# Altium project Compressor.PrjPcb (part 4 of 4)
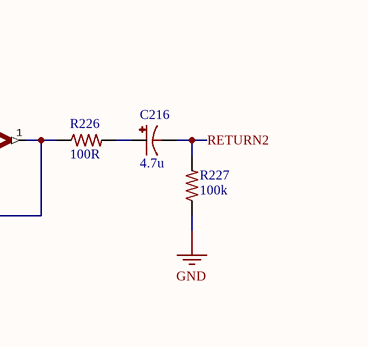
[diagram p6: Compressor.SchDoc, bottom right]

## Sheet Compressor.SchDoc (continued)

### Library data of the parts (continued)
R120 R222 R226 = CRCW0603100RFKEA: RES SMD 100 OHM 1% 1/10W 0603; Manufacturer: Vishay Dale; Power Rating: 100mW; Temperature Coefficient: 100ppm/°C; Voltage Rating (DC): 75V; Supplier 1: Farnell; Supplier Part Number 1: 1469752; Manufacturer Part Number: CRCW0603100RFKEA; Stock: 394970; Pricing: 10=0.0171, 100=0.0131, 500=0.0114, 1000=0.0068 (EUR); RoHS: Yes; Mount: Surface Mount; Case/Package: 0603; Number of Pins: 2; Weight: 7.1E-05oz; Contact Plating: Tin; Case Code (Metric): 1608; Case Code (Imperial): 0603; Min Operating Temperature: -55°C; Max Operating Temperature: 155°C; Resistance: 100R; Tolerance: 1%; Composition: Thick Film; Packaging: Tape and Reel; Package Quantity: 10; Voltage Rating: 75V; Number of Terminations: 2; Termination: SMD/SMT; Military Standard: Not; Max Power Dissipation: 100mW; Features: Automotive AEC-Q200; Length: 1.55mm; Height: 0.02inch; Width: 0.033inch; Depth: 0.85mm; Radiation Hardening: No; Lead Free: Lead Free; REACH SVHC: Unknown; ComponentLink1URL: https://datasheet.ciiva.com/16941/dcrcwe3-16941318.pdf?src-supplier=Avnet+Europe; ComponentLink1Description: https://datasheet.ciiva.com/16941/dcrcwe3-16941318.pdf?src-supplier=Avnet+Europe; ComponentLink2URL: https://datasheet.ciiva.com/2465/dcrcwe3-2465543.pdf?src-supplier=Digi-Key; ComponentLink2Description: https://datasheet.ciiva.com/2465/dcrcwe3-2465543.pdf?src-supplier=Digi-Key; ComponentLink3URL: https://datasheet.ciiva.com/2465/dcrcwe3-2465544.pdf?src-supplier=Digi-Key; ComponentLink3Description: https://datasheet.ciiva.com/2465/dcrcwe3-2465544.pdf?src-supplier=Digi-Key; ComponentLink4URL: https://datasheet.ciiva.com/2465/dcrcwe3-2465545.pdf?src-supplier=Digi-Key; ComponentLink4Description: https://datasheet.ciiva.com/2465/dcrcwe3-2465545.pdf?src-supplier=Digi-Key; ComponentLink5URL: https://datasheet.ciiva.com/22673/1697337-22673066.pdf?src-supplier=Element14; ComponentLink5Description: https://datasheet.ciiva.com/22673/1697337-22673066.pdf?src-supplier=Element14; ComponentLink6URL: https://datasheet.ciiva.com/16199/dcrcwe3-16199102.pdf?src-supplier=Future+Electronics; ComponentLink6Description: https://datasheet.ciiva.com/16199/dcrcwe3-16199102.pdf?src-supplier=Future+Electronics; ComponentLink7URL: https://datasheet.ciiva.com/16721/70201119-16721486.pdf?src-supplier=Allied+Electronics; ComponentLink7Description: https://datasheet.ciiva.com/16721/70201119-16721486.pdf?src-supplier=Allied+Electronics; ComponentLink8URL: https://datasheet.ciiva.com/22666/1720486-22666207.pdf?src-supplier=Element14; ComponentLink8Description: https://datasheet.ciiva.com/22666/1720486-22666207.pdf?src-supplier=Element14; ComponentLink9URL: https://datasheet.ciiva.com/26316/fld-crcw-e3-data-en-26316566.pdf?src-supplier=Distrelec; ComponentLink9Description: https://datasheet.ciiva.com/26316/fld-crcw-e3-data-en-26316566.pdf?src-supplier=Distrelec; ComponentLink10URL: https://datasheet.ciiva.com/16787/70201119-16787964.pdf?src-supplier=Allied+Electronics; ComponentLink10Description: https://datasheet.ciiva.com/16787/70201119-16787964.pdf?src-supplier=Allied+Electronics; ComponentLink11URL: https://datasheet.ciiva.com/5550/dcrcwe3-109170-5550286.pdf?src-supplier=Mouser; ComponentLink11Description: https://datasheet.ciiva.com/5550/dcrcwe3-109170-5550286.pdf?src-supplier=Mouser; Price: 0.0129
R122 = CRCW0603300KFKEA: RES SMD 300K OHM 1% 1/10W 0603; Manufacturer: Vishay; Resistance: 300kR; Temperature Coefficient: 100ppm/°C; Power Rating: 100mW; Voltage Rating: 75V; Supplier 1: Farnell; Supplier Part Number 1: 1652871; Manufacturer Part Number: CRCW0603300KFKEA; RoHS: Yes; Category: Chip SMD Resistors; Stock: 21563; Pricing: 10=0.04580, 100=0.01840, 500=0.01410, 1000=0.00700, 2500=0.00580 (EUR); Mount: Surface Mount; Case/Package: 0603; Number of Pins: 2; Weight: 7.1E-05oz; Contact Plating: Tin; Case Code (Metric): 1608; Case Code (Imperial): 0603; Min Operating Temperature: -55°C; Max Operating Temperature: 155°C; Tolerance: 1%; Composition: Thick Film; Packaging: Tape and Reel; Number of Terminations: 2; Termination: SMD/SMT; Max Power Dissipation: 100mW; Package Quantity: 10; Features: Automotive AEC-Q200; Military Standard: Not; Voltage Rating (DC): 75V; Length: 1.55mm; Height: 0.45mm; Width: 0.033inch; Depth: 0.85mm; Radiation Hardening: No; Lead Free: Lead Free; REACH SVHC: Unknown; ComponentLink1URL: https://datasheet.ciiva.com/11818/0900766b80d98afc-11818169.pdf?src-supplier=RSComponents; ComponentLink1Description: https://datasheet.ciiva.com/11818/0900766b80d98afc-11818169.pdf?src-supplier=RSComponents; ComponentLink2URL: https://datasheet.ciiva.com/7674/1697337-7674069.pdf?src-supplier=Element14; ComponentLink2Description: https://datasheet.ciiva.com/7674/1697337-7674069.pdf?src-supplier=Element14; ComponentLink3URL: https://datasheet.ciiva.com/7674/1533075-7674214.pdf?src-supplier=Element14; ComponentLink3Description: https://datasheet.ciiva.com/7674/1533075-7674214.pdf?src-supplier=Element14; ComponentLink4URL: https://datasheet.ciiva.com/16784/70201119-16784232.pdf?src-supplier=Allied+Electronics; ComponentLink4Description: https://datasheet.ciiva.com/16784/70201119-16784232.pdf?src-supplier=Allied+Electronics; ComponentLink5URL: https://datasheet.ciiva.com/26317/fld-crcw-e3-data-en-26317176.pdf?src-supplier=Distrelec; ComponentLink5Description: https://datasheet.ciiva.com/26317/fld-crcw-e3-data-en-26317176.pdf?src-supplier=Distrelec; ComponentLink6URL: https://datasheet.ciiva.com/16893/dcrcwe3-16893193.pdf?src-supplier=Avnet+Europe; ComponentLink6Description: https://datasheet.ciiva.com/16893/dcrcwe3-16893193.pdf?src-supplier=Avnet+Europe; ComponentLink7URL: https://datasheet.ciiva.com/5549/dcrcwe3-109170-5549837.pdf?src-supplier=Mouser; ComponentLink7Description: https://datasheet.ciiva.com/5549/dcrcwe3-109170-5549837.pdf?src-supplier=Mouser; ComponentLink8URL: https://datasheet.ciiva.com/2466/dcrcwe3-2466314.pdf?src-supplier=Digi-Key; ComponentLink8Description: https://datasheet.ciiva.com/2466/dcrcwe3-2466314.pdf?src-supplier=Digi-Key; ComponentLink9URL: https://datasheet.ciiva.com/2466/dcrcwe3-2466315.pdf?src-supplier=Digi-Key; ComponentLink9Description: https://datasheet.ciiva.com/2466/dcrcwe3-2466315.pdf?src-supplier=Digi-Key; ComponentLink10URL: https://datasheet.ciiva.com/2466/dcrcwe3-2466316.pdf?src-supplier=Digi-Key; ComponentLink10Description: https://datasheet.ciiva.com/2466/dcrcwe3-2466316.pdf?src-supplier=Digi-Key
R124 = CRCW060327K0FKEA: RES SMD 27K OHM 1% 1/10W 0603; Manufacturer: Vishay; Resistance: 27kR; Power Rating: 100mW; Temperature Coefficient: 100ppm/°C; Voltage Rating: 75V; Supplier 1: Farnell; Supplier Part Number 1: 1652864; Manufacturer Part Number: CRCW060327K0FKEA; Stock: 74674; Pricing: 10=0.0169, 100=0.013, 500=0.0113, 1000=0.0068 (EUR); RoHS: Yes; Mount: Surface Mount; Case/Package: 0603; Number of Pins: 2; Weight: 7.1E-05oz; Contact Plating: Tin; Case Code (Imperial): 0603; Case Code (Metric): 1608; Min Operating Temperature: -55°C; Max Operating Temperature: 155°C; Tolerance: 1%; Composition: Thick Film; Packaging: Tape and Reel; Termination: SMD/SMT; Package Quantity: 10; Number of Terminations: 2; Military Standard: Not; Max Power Dissipation: 100mW; Voltage Rating (DC): 75V; Features: Automotive AEC-Q200; Length: 1.55mm; Height: 0.45mm; Width: 0.85mm; Depth: 0.85mm; Radiation Hardening: No; REACH SVHC: Unknown; Lead Free: Lead Free; ComponentLink1URL: https://datasheet.ciiva.com/11810/0900766b80d98afc-11810797.pdf?src-supplier=RSComponents; ComponentLink1Description: https://datasheet.ciiva.com/11810/0900766b80d98afc-11810797.pdf?src-supplier=RSComponents; ComponentLink2URL: https://datasheet.ciiva.com/7841/1697337-7841575.pdf?src-supplier=Element14; ComponentLink2Description: https://datasheet.ciiva.com/7841/1697337-7841575.pdf?src-supplier=Element14; ComponentLink3URL: https://datasheet.ciiva.com/15159/getdatasheetpartid-45808-15159562.pdf?src-supplier=Verical; ComponentLink3Description: https://datasheet.ciiva.com/15159/getdatasheetpartid-45808-15159562.pdf?src-supplier=Verical; ComponentLink4URL: https://datasheet.ciiva.com/26314/fld-crcw-e3-data-en-26314668.pdf?src-supplier=Distrelec; ComponentLink4Description: https://datasheet.ciiva.com/26314/fld-crcw-e3-data-en-26314668.pdf?src-supplier=Distrelec; ComponentLink5URL: https://datasheet.ciiva.com/2466/dcrcwe3-2466269.pdf?src-supplier=Digi-Key; ComponentLink5Description: https://datasheet.ciiva.com/2466/dcrcwe3-2466269.pdf?src-supplier=Digi-Key; ComponentLink6URL: https://datasheet.ciiva.com/2466/dcrcwe3-2466271.pdf?src-supplier=Digi-Key; ComponentLink6Description: https://datasheet.ciiva.com/2466/dcrcwe3-2466271.pdf?src-supplier=Digi-Key; ComponentLink7URL: https://datasheet.ciiva.com/16395/dcrcwe3-16395398.pdf?src-supplier=Future+Electronics; ComponentLink7Description: https://datasheet.ciiva.com/16395/dcrcwe3-16395398.pdf?src-supplier=Future+Electronics; ComponentLink8URL: https://datasheet.ciiva.com/16893/dcrcw-16893962.pdf?src-supplier=Avnet+Europe; ComponentLink8Description: https://datasheet.ciiva.com/16893/dcrcw-16893962.pdf?src-supplier=Avnet+Europe; ComponentLink9URL: https://datasheet.ciiva.com/2466/dcrcwe3-2466270.pdf?src-supplier=Digi-Key; ComponentLink9Description: https://datasheet.ciiva.com/2466/dcrcwe3-2466270.pdf?src-supplier=Digi-Key; ComponentLink10URL: https://datasheet.ciiva.com/22871/70201119-22871598.pdf?src-supplier=Allied+Electronics; ComponentLink10Description: https://datasheet.ciiva.com/22871/70201119-22871598.pdf?src-supplier=Allied+Electronics; Price: 0.0129
R127 R212 R215 R224 R227 = CRCW0603100KFKEA: RES SMD 100K OHM 1% 1/10W 0603; Manufacturer: Vishay; Resistance: 100kR; Temperature Coefficient: 100ppm/°C; Power Rating: 100mW; Voltage Rating: 75V; Supplier 1: Farnell; Supplier Part Number 1: 1469649; Manufacturer Part Number: CRCW0603100KFKEA; Stock: 573766; Pricing: 10=0.0169, 100=0.013, 500=0.0113, 1000=0.0068 (EUR); RoHS: Yes; Case/Package: 0603; Number of Pins: 2; Weight: 7.1E-05oz; Contact Plating: Tin; Case Code (Metric): 1608; Case Code (Imperial): 0603; Min Operating Temperature: -55°C; Max Operating Temperature: 155°C; Tolerance: 1%; Composition: Thick Film; Termination: SMD/SMT; Packaging: Tape and Reel; Package Quantity: 10; Number of Terminations: 2; Military Standard: Not; Max Power Dissipation: 100mW; Voltage Rating (DC): 75V; Features: Automotive AEC-Q200; Length: 1.55mm; Height: 0.45mm; Width: 0.033inch; Depth: 0.85mm; Radiation Hardening: No; Lead Free: Lead Free; REACH SVHC: Unknown; ComponentLink1URL: https://datasheet.ciiva.com/11809/0900766b80d98afc-11809004.pdf?src-supplier=RSComponents; ComponentLink1Description: https://datasheet.ciiva.com/11809/0900766b80d98afc-11809004.pdf?src-supplier=RSComponents; ComponentLink2URL: https://datasheet.ciiva.com/2465/dcrcwe3-2465525.pdf?src-supplier=Digi-Key; ComponentLink2Description: https://datasheet.ciiva.com/2465/dcrcwe3-2465525.pdf?src-supplier=Digi-Key; ComponentLink3URL: https://datasheet.ciiva.com/7777/1697337-7777269.pdf?src-supplier=Element14; ComponentLink3Description: https://datasheet.ciiva.com/7777/1697337-7777269.pdf?src-supplier=Element14; ComponentLink4URL: https://datasheet.ciiva.com/15159/getdatasheetpartid-93113-15159925.pdf?src-supplier=Verical; ComponentLink4Description: https://datasheet.ciiva.com/15159/getdatasheetpartid-93113-15159925.pdf?src-supplier=Verical; ComponentLink5URL: https://datasheet.ciiva.com/46441/1720486-46441605.pdf?src-supplier=Element14; ComponentLink5Description: https://datasheet.ciiva.com/46441/1720486-46441605.pdf?src-supplier=Element14; ComponentLink6URL: https://datasheet.ciiva.com/2465/dcrcwe3-2465526.pdf?src-supplier=Digi-Key; ComponentLink6Description: https://datasheet.ciiva.com/2465/dcrcwe3-2465526.pdf?src-supplier=Digi-Key; ComponentLink7URL: https://datasheet.ciiva.com/2465/dcrcwe3-2465527.pdf?src-supplier=Digi-Key; ComponentLink7Description: https://datasheet.ciiva.com/2465/dcrcwe3-2465527.pdf?src-supplier=Digi-Key; ComponentLink8URL: https://datasheet.ciiva.com/8340/dcrcwe3-8340199.pdf?src-supplier=Avnet; ComponentLink8Description: https://datasheet.ciiva.com/8340/dcrcwe3-8340199.pdf?src-supplier=Avnet; ComponentLink9URL: https://datasheet.ciiva.com/16725/70201119-16725223.pdf?src-supplier=Allied+Electronics; ComponentLink9Description: https://datasheet.ciiva.com/16725/70201119-16725223.pdf?src-supplier=Allied+Electronics; ComponentLink10URL: https://datasheet.ciiva.com/8340/dcrcwe3-8340201.pdf?src-supplier=Avnet; ComponentLink10Description: https://datasheet.ciiva.com/8340/dcrcwe3-8340201.pdf?src-supplier=Avnet; ComponentLink11URL: https://datasheet.ciiva.com/7791/66915-7791994.pdf?src-supplier=Element14; ComponentLink11Description: https://datasheet.ciiva.com/7791/66915-7791994.pdf?src-supplier=Element14; ComponentLink12URL: https://datasheet.ciiva.com/5545/dcrcwe3-109170-5545100.pdf?src-supplier=Mouser; ComponentLink12Description: https://datasheet.ciiva.com/5545/dcrcwe3-109170-5545100.pdf?src-supplier=Mouser; ComponentLink13URL: https://datasheet.ciiva.com/26317/fld-crcw-e3-data-en-26317165.pdf?src-supplier=Distrelec; ComponentLink13Description: https://datasheet.ciiva.com/26317/fld-crcw-e3-data-en-26317165.pdf?src-supplier=Distrelec; ComponentLink14URL: https://datasheet.ciiva.com/16941/dcrcw-16941311.pdf?src-supplier=Avnet+Europe; ComponentLink14Description: https://datasheet.ciiva.com/16941/dcrcw-16941311.pdf?src-supplier=Avnet+Europe; Price: 0.0136
R128 = CRCW0603120KFKEA: RES SMD 120K OHM 1% 1/10W 0603; Manufacturer: Vishay; Resistance: 120kR; Temperature Coefficient: 100ppm/°C; Power Rating: 100mW; Voltage Rating: 75V; Supplier 1: Farnell; Supplier Part Number 1: 2138506; Manufacturer Part Number: CRCW0603120KFKEA; Stock: 33845; Pricing: 10=0.0212, 100=0.0163, 500=0.0141, 1000=0.008 (EUR); RoHS: Yes; Mount: Surface Mount; Case/Package: 0603; Number of Pins: 2; Weight: 7.1E-05oz; Contact Plating: Tin; Case Code (Imperial): 0603; Case Code (Metric): 1608; Min Operating Temperature: -55°C; Max Operating Temperature: 155°C; Tolerance: 1%; Composition: Thick Film; Packaging: Tape and Reel; Package Quantity: 5000; Number of Terminations: 2; Military Standard: Not; Termination: SMD/SMT; Voltage Rating (DC): 75V; Working Voltage: 75V; Length: 1.55mm; Height: 0.45mm; Width: 0.85mm; Depth: 0.85mm; Radiation Hardening: No; Lead Free: Lead Free; REACH SVHC: Unknown; ComponentLink1URL: https://datasheet.ciiva.com/11808/0900766b80d98afc-11808706.pdf?src-supplier=RSComponents; ComponentLink1Description: https://datasheet.ciiva.com/11808/0900766b80d98afc-11808706.pdf?src-supplier=RSComponents; ComponentLink2URL: https://datasheet.ciiva.com/22868/70201119-22868869.pdf?src-supplier=Allied+Electronics; ComponentLink2Description: https://datasheet.ciiva.com/22868/70201119-22868869.pdf?src-supplier=Allied+Electronics; ComponentLink3URL: https://datasheet.ciiva.com/22744/dcrcwe3-22744182.pdf?src-supplier=Farnell; ComponentLink3Description: https://datasheet.ciiva.com/22744/dcrcwe3-22744182.pdf?src-supplier=Farnell; ComponentLink4URL: https://datasheet.ciiva.com/16772/70201119-16772041.pdf?src-supplier=Allied+Electronics; ComponentLink4Description: https://datasheet.ciiva.com/16772/70201119-16772041.pdf?src-supplier=Allied+Electronics; ComponentLink5URL: https://datasheet.ciiva.com/16941/dcrcwe3-16941354.pdf?src-supplier=Avnet+Europe; ComponentLink5Description: https://datasheet.ciiva.com/16941/dcrcwe3-16941354.pdf?src-supplier=Avnet+Europe; ComponentLink6URL: https://datasheet.ciiva.com/16200/dcrcwe3-16200011.pdf?src-supplier=Future+Electronics; ComponentLink6Description: https://datasheet.ciiva.com/16200/dcrcwe3-16200011.pdf?src-supplier=Future+Electronics; ComponentLink7URL: https://datasheet.ciiva.com/3256/dcrcwe3-3256988.pdf?src-supplier=Avnet; ComponentLink7Description: https://datasheet.ciiva.com/3256/dcrcwe3-3256988.pdf?src-supplier=Avnet; ComponentLink8URL: https://datasheet.ciiva.com/7714/1720486-7714204.pdf?src-supplier=Element14; ComponentLink8Description: https://datasheet.ciiva.com/7714/1720486-7714204.pdf?src-supplier=Element14; ComponentLink9URL: https://datasheet.ciiva.com/7714/1697337-7714205.pdf?src-supplier=Element14; ComponentLink9Description: https://datasheet.ciiva.com/7714/1697337-7714205.pdf?src-supplier=Element14; ComponentLink10URL: https://datasheet.ciiva.com/22708/1720486-22708061.pdf?src-supplier=Element14; ComponentLink10Description: https://datasheet.ciiva.com/22708/1720486-22708061.pdf?src-supplier=Element14; ComponentLink11URL: https://datasheet.ciiva.com/8340/dcrcwe3-8340031.pdf?src-supplier=Avnet; ComponentLink11Description: https://datasheet.ciiva.com/8340/dcrcwe3-8340031.pdf?src-supplier=Avnet; ComponentLink12URL: https://datasheet.ciiva.com/26317/fld-crcw-e3-data-en-26317167.pdf?src-supplier=Distrelec; ComponentLink12Description: https://datasheet.ciiva.com/26317/fld-crcw-e3-data-en-26317167.pdf?src-supplier=Distrelec; Price: 0.0165
R133 = CRCW060356K0FKEA: RES SMD 56K OHM 1% 1/10W 0603; Manufacturer: Vishay; Resistance: 56kR; Temperature Coefficient: 100ppm/°C; Power Rating: 100mW; Voltage Rating (DC): 75V; Supplier 1: Farnell; Supplier Part Number 1: 2138473; Manufacturer Part Number: CRCW060356K0FKEA; RoHS: Yes; Category: Chip SMD Resistors; Stock: 31470; Pricing: 10=0.04580, 100=0.01840, 500=0.01580, 1000=0.00700, 2500=0.00550 (EUR); Case/Package: 0603; Number of Pins: 2; Weight: 7.1E-05oz; Contact Plating: Tin,Lead; Case Code (Metric): 1608; Case Code (Imperial): 0603; Min Operating Temperature: -55°C; Max Operating Temperature: 155°C; Tolerance: 1%; Termination: SMD/SMT; Packaging: Tape and Reel; Composition: Thick Film; Max Power Dissipation: 100mW; Number of Terminations: 2; Military Standard: Not; Voltage Rating: 75V; Package Quantity: 10; Features: Automotive AEC-Q200; Length: 1.55mm; Height: 0.45mm; Depth: 0.85mm; Width: 0.033inch; Radiation Hardening: No; Lead Free: Lead Free; REACH SVHC: Unknown; ComponentLink1URL: https://datasheet.ciiva.com/3883/41394838s8306212n6892-3883398.pdf?src-supplier=Arrow; ComponentLink1Description: https://datasheet.ciiva.com/3883/41394838s8306212n6892-3883398.pdf?src-supplier=Arrow; ComponentLink2URL: https://datasheet.ciiva.com/11810/0900766b80d98afc-11810386.pdf?src-supplier=RSComponents; ComponentLink2Description: https://datasheet.ciiva.com/11810/0900766b80d98afc-11810386.pdf?src-supplier=RSComponents; ComponentLink3URL: https://datasheet.ciiva.com/3257/dcrcwe3-3257733.pdf?src-supplier=Avnet; ComponentLink3Description: https://datasheet.ciiva.com/3257/dcrcwe3-3257733.pdf?src-supplier=Avnet; ComponentLink4URL: https://datasheet.ciiva.com/7841/1697337-7841608.pdf?src-supplier=Element14; ComponentLink4Description: https://datasheet.ciiva.com/7841/1697337-7841608.pdf?src-supplier=Element14; ComponentLink5URL: https://datasheet.ciiva.com/7841/1697337-7841609.pdf?src-supplier=Element14; ComponentLink5Description: https://datasheet.ciiva.com/7841/1697337-7841609.pdf?src-supplier=Element14; ComponentLink6URL: https://datasheet.ciiva.com/22683/1912744-22683305.pdf?src-supplier=Element14; ComponentLink6Description: https://datasheet.ciiva.com/22683/1912744-22683305.pdf?src-supplier=Element14; ComponentLink7URL: https://datasheet.ciiva.com/2465/dcrcwe3-2465546.pdf?src-supplier=Digi-Key; ComponentLink7Description: https://datasheet.ciiva.com/2465/dcrcwe3-2465546.pdf?src-supplier=Digi-Key; ComponentLink8URL: https://datasheet.ciiva.com/22704/1697337-22704442.pdf?src-supplier=Element14; ComponentLink8Description: https://datasheet.ciiva.com/22704/1697337-22704442.pdf?src-supplier=Element14; ComponentLink9URL: https://datasheet.ciiva.com/22872/70201119-22872026.pdf?src-supplier=Allied+Electronics; ComponentLink9Description: https://datasheet.ciiva.com/22872/70201119-22872026.pdf?src-supplier=Allied+Electronics; ComponentLink10URL: https://datasheet.ciiva.com/2465/dcrcwe3-2465547.pdf?src-supplier=Digi-Key; ComponentLink10Description: https://datasheet.ciiva.com/2465/dcrcwe3-2465547.pdf?src-supplier=Digi-Key; ComponentLink11URL: https://datasheet.ciiva.com/5545/dcrcwe3-109170-5545612.pdf?src-supplier=Mouser; ComponentLink11Description: https://datasheet.ciiva.com/5545/dcrcwe3-109170-5545612.pdf?src-supplier=Mouser; ComponentLink12URL: https://datasheet.ciiva.com/2465/dcrcwe3-2465548.pdf?src-supplier=Digi-Key; ComponentLink12Description: https://datasheet.ciiva.com/2465/dcrcwe3-2465548.pdf?src-supplier=Digi-Key
R204 R206 = CRCW06032M20FKEA: RES SMD 2.2M OHM 1% 1/10W 0603; Manufacturer: Vishay; Resistance: 2.2MR; Power Rating: 100mW; Temperature Coefficient: 100ppm/°C; Voltage Rating: 75V; Supplier 1: Farnell; Supplier Part Number 1: 2138646; Manufacturer Part Number: CRCW06032M20FKEA; Stock: 19125; Pricing: 10=0.0212, 100=0.0163, 500=0.0141, 1000=0.0073 (EUR); RoHS: Yes; Mount: Surface Mount; Case/Package: 0603; Number of Pins: 2; Weight: 7.1E-05oz; Contact Plating: Tin; Case Code (Imperial): 0603; Case Code (Metric): 1608; Min Operating Temperature: -55°C; Max Operating Temperature: 155°C; Tolerance: 1%; Packaging: Tape and Reel; Composition: Thick Film; Termination: SMD/SMT; Package Quantity: 10; Number of Terminations: 2; Military Standard: Not; Max Power Dissipation: 100mW; Voltage Rating (DC): 75V; Features: Automotive AEC-Q200; Length: 1.55mm; Height: 0.45mm; Width: 0.85mm; Depth: 0.85mm; Radiation Hardening: No; Lead Free: Lead Free; REACH SVHC: Unknown; ComponentLink1URL: https://datasheet.ciiva.com/11810/0900766b80d98afc-11810588.pdf?src-supplier=RSComponents; ComponentLink1Description: https://datasheet.ciiva.com/11810/0900766b80d98afc-11810588.pdf?src-supplier=RSComponents; ComponentLink2URL: https://datasheet.ciiva.com/2466/dcrcwe3-2466118.pdf?src-supplier=Digi-Key; ComponentLink2Description: https://datasheet.ciiva.com/2466/dcrcwe3-2466118.pdf?src-supplier=Digi-Key; ComponentLink3URL: https://datasheet.ciiva.com/22682/1912744-22682662.pdf?src-supplier=Element14; ComponentLink3Description: https://datasheet.ciiva.com/22682/1912744-22682662.pdf?src-supplier=Element14; ComponentLink4URL: https://datasheet.ciiva.com/7801/1697337-7801067.pdf?src-supplier=Element14; ComponentLink4Description: https://datasheet.ciiva.com/7801/1697337-7801067.pdf?src-supplier=Element14; ComponentLink5URL: https://datasheet.ciiva.com/22869/70201119-22869819.pdf?src-supplier=Allied+Electronics; ComponentLink5Description: https://datasheet.ciiva.com/22869/70201119-22869819.pdf?src-supplier=Allied+Electronics; ComponentLink6URL: https://datasheet.ciiva.com/26314/fld-crcw-e3-data-en-26314653.pdf?src-supplier=Distrelec; ComponentLink6Description: https://datasheet.ciiva.com/26314/fld-crcw-e3-data-en-26314653.pdf?src-supplier=Distrelec; ComponentLink7URL: https://datasheet.ciiva.com/3257/dcrcwe3-3257407.pdf?src-supplier=Avnet; ComponentLink7Description: https://datasheet.ciiva.com/3257/dcrcwe3-3257407.pdf?src-supplier=Avnet; ComponentLink8URL: https://datasheet.ciiva.com/2466/dcrcwe3-2466116.pdf?src-supplier=Digi-Key; ComponentLink8Description: https://datasheet.ciiva.com/2466/dcrcwe3-2466116.pdf?src-supplier=Digi-Key; ComponentLink9URL: https://datasheet.ciiva.com/2466/dcrcwe3-2466117.pdf?src-supplier=Digi-Key; ComponentLink9Description: https://datasheet.ciiva.com/2466/dcrcwe3-2466117.pdf?src-supplier=Digi-Key; ComponentLink10URL: https://datasheet.ciiva.com/16498/dcrcwe3-16498313.pdf?src-supplier=Future+Electronics; ComponentLink10Description: https://datasheet.ciiva.com/16498/dcrcwe3-16498313.pdf?src-supplier=Future+Electronics; ComponentLink11URL: https://datasheet.ciiva.com/7801/1697337-7801066.pdf?src-supplier=Element14; ComponentLink11Description: https://datasheet.ciiva.com/7801/1697337-7801066.pdf?src-supplier=Element14; Price: 0.0165
R207 = CRCW060324K0FKEA: RES SMD 24K OHM 1% 1/10W 0603; Manufacturer: Vishay; Resistance: 24kR; Power Rating: 100mW; Temperature Coefficient: 100ppm/°C; Working Voltage: 75V; Supplier 1: Farnell; Supplier Part Number 1: 1469784; Manufacturer Part Number: CRCW060324K0FKEA; RoHS: Yes; Category: Chip SMD Resistors; Stock: 11971; Pricing: 10=0.04580, 100=0.01840, 500=0.01580, 1000=0.00700, 2500=0.00580 (EUR); Mount: Surface Mount; Case/Package: 0603; Weight: 7.1E-05oz; Contact Plating: Tin; Case Code (Metric): 1608; Case Code (Imperial): 0603; Min Operating Temperature: -55°C; Max Operating Temperature: 155°C; Tolerance: 1%; Termination: SMD/SMT; Composition: Thick Film; Packaging: Tape and Reel; Number of Terminations: 2; Package Quantity: 10; Features: Automotive AEC-Q200; Max Power Dissipation: 100mW; Military Standard: Not; Voltage Rating: 75V; Voltage Rating (DC): 75V; Length: 1.55mm; Height: 0.45mm; Width: 0.033inch; Depth: 0.85mm; Radiation Hardening: No; Lead Free: Lead Free; REACH SVHC: Unknown; ComponentLink1URL: https://datasheet.ciiva.com/11811/0900766b80d98afc-11811708.pdf?src-supplier=RSComponents; ComponentLink1Description: https://datasheet.ciiva.com/11811/0900766b80d98afc-11811708.pdf?src-supplier=RSComponents; ComponentLink2URL: https://datasheet.ciiva.com/2525/dcrcwe3-2525284.pdf?src-supplier=Digi-Key; ComponentLink2Description: https://datasheet.ciiva.com/2525/dcrcwe3-2525284.pdf?src-supplier=Digi-Key; ComponentLink3URL: https://datasheet.ciiva.com/2525/dcrcwe3-2525285.pdf?src-supplier=Digi-Key; ComponentLink3Description: https://datasheet.ciiva.com/2525/dcrcwe3-2525285.pdf?src-supplier=Digi-Key; ComponentLink4URL: https://datasheet.ciiva.com/2525/dcrcwe3-2525286.pdf?src-supplier=Digi-Key; ComponentLink4Description: https://datasheet.ciiva.com/2525/dcrcwe3-2525286.pdf?src-supplier=Digi-Key; ComponentLink5URL: https://datasheet.ciiva.com/3257/dcrcwe3-3257304.pdf?src-supplier=Avnet; ComponentLink5Description: https://datasheet.ciiva.com/3257/dcrcwe3-3257304.pdf?src-supplier=Avnet; ComponentLink6URL: https://datasheet.ciiva.com/16199/dcrcwe3-16199433.pdf?src-supplier=Future+Electronics; ComponentLink6Description: https://datasheet.ciiva.com/16199/dcrcwe3-16199433.pdf?src-supplier=Future+Electronics; ComponentLink7URL: https://datasheet.ciiva.com/22868/70201119-22868826.pdf?src-supplier=Allied+Electronics; ComponentLink7Description: https://datasheet.ciiva.com/22868/70201119-22868826.pdf?src-supplier=Allied+Electronics; ComponentLink8URL: https://datasheet.ciiva.com/16759/70201119-16759451.pdf?src-supplier=Allied+Electronics; ComponentLink8Description: https://datasheet.ciiva.com/16759/70201119-16759451.pdf?src-supplier=Allied+Electronics; ComponentLink9URL: https://datasheet.ciiva.com/16882/dcrcwe3-16882667.pdf?src-supplier=Avnet+Europe; ComponentLink9Description: https://datasheet.ciiva.com/16882/dcrcwe3-16882667.pdf?src-supplier=Avnet+Europe; ComponentLink10URL: https://datasheet.ciiva.com/26314/fld-crcw-e3-data-en-26314667.pdf?src-supplier=Distrelec; ComponentLink10Description: https://datasheet.ciiva.com/26314/fld-crcw-e3-data-en-26314667.pdf?src-supplier=Distrelec; ComponentLink11URL: https://datasheet.ciiva.com/7671/1697337-7671612.pdf?src-supplier=Element14; ComponentLink11Description: https://datasheet.ciiva.com/7671/1697337-7671612.pdf?src-supplier=Element14; ComponentLink12URL: https://datasheet.ciiva.com/5546/dcrcwe3-109170-5546077.pdf?src-supplier=Mouser; ComponentLink12Description: https://datasheet.ciiva.com/5546/dcrcwe3-109170-5546077.pdf?src-supplier=Mouser
R218 = CRCW06034K70FKEA: RES SMD 4.7K OHM 1% 1/10W 0603; Manufacturer: Vishay; Resistance: 4.7kR; Temperature Coefficient: 100ppm/°C; Power Rating: 100mW; Voltage Rating: 75V; Supplier 1: Farnell; Supplier Part Number 1: 1469807; Manufacturer Part Number: CRCW06034K70FKEA; Stock: 238464; Pricing: 10=0.0169, 100=0.013, 500=0.0113, 1000=0.0074 (EUR); RoHS: Yes; Mount: Surface Mount; Case/Package: 0603; Weight: 7.1E-05oz; Contact Plating: Tin; Case Code (Imperial): 0603; Case Code (Metric): 1608; Min Operating Temperature: -55°C; Max Operating Temperature: 155°C; Tolerance: 1%; Composition: Thick Film; Termination: SMD/SMT; Packaging: Tape and Reel; Package Quantity: 5000; Military Standard: Not; Voltage Rating (DC): 75V; Length: 1.55mm; Height: 0.45mm; Width: 0.85mm; Depth: 0.85mm; Lead Free: Lead Free; REACH SVHC: Unknown; ComponentLink1URL: https://datasheet.ciiva.com/11809/0900766b80d98afc-11809859.pdf?src-supplier=RSComponents; ComponentLink1Description: https://datasheet.ciiva.com/11809/0900766b80d98afc-11809859.pdf?src-supplier=RSComponents; ComponentLink2URL: https://datasheet.ciiva.com/8079/1697337-8079646.pdf?src-supplier=Element14; ComponentLink2Description: https://datasheet.ciiva.com/8079/1697337-8079646.pdf?src-supplier=Element14; ComponentLink3URL: https://datasheet.ciiva.com/15159/getdatasheetpartid-33073-15159382.pdf?src-supplier=Verical; ComponentLink3Description: https://datasheet.ciiva.com/15159/getdatasheetpartid-33073-15159382.pdf?src-supplier=Verical; ComponentLink4URL: https://datasheet.ciiva.com/16199/dcrcwe3-16199366.pdf?src-supplier=Future+Electronics; ComponentLink4Description: https://datasheet.ciiva.com/16199/dcrcwe3-16199366.pdf?src-supplier=Future+Electronics; ComponentLink5URL: https://datasheet.ciiva.com/16764/70201119-16764918.pdf?src-supplier=Allied+Electronics; ComponentLink5Description: https://datasheet.ciiva.com/16764/70201119-16764918.pdf?src-supplier=Allied+Electronics; ComponentLink6URL: https://datasheet.ciiva.com/16520/dcrcwe3-16520616.pdf?src-supplier=Avnet+Asia; ComponentLink6Description: https://datasheet.ciiva.com/16520/dcrcwe3-16520616.pdf?src-supplier=Avnet+Asia; ComponentLink7URL: https://datasheet.ciiva.com/16724/70201119-16724106.pdf?src-supplier=Allied+Electronics; ComponentLink7Description: https://datasheet.ciiva.com/16724/70201119-16724106.pdf?src-supplier=Allied+Electronics; ComponentLink8URL: https://datasheet.ciiva.com/26314/fld-crcw-e3-data-en-26314735.pdf?src-supplier=Distrelec; ComponentLink8Description: https://datasheet.ciiva.com/26314/fld-crcw-e3-data-en-26314735.pdf?src-supplier=Distrelec; Price: 0.0131
R220 = CRCW060351K0FKEA: RES SMD 51K OHM 1% 1/10W 0603; Manufacturer: Vishay; Resistance: 51kR; Temperature Coefficient: 100ppm/°C; Max Power Dissipation: 100mW; Voltage Rating (DC): 75V; Supplier 1: Farnell; Supplier Part Number 1: 1469822; Manufacturer Part Number: CRCW060351K0FKEA; RoHS: Yes; Category: Chip SMD Resistors; Stock: 38550; Pricing: 10=0.04580, 100=0.01840, 500=0.01580, 1000=0.00700, 2500=0.00580 (EUR); Case/Package: 0603; Number of Pins: 2; Weight: 7.1E-05oz; Case Code (Imperial): 0603; Case Code (Metric): 1608; Contact Plating: Tin; Min Operating Temperature: -55°C; Max Operating Temperature: 155°C; Tolerance: 1%; Composition: Thick Film; Packaging: Tape and Reel; Number of Terminations: 2; Features: Automotive AEC-Q200; Termination: SMD/SMT; Power Rating: 100mW; Package Quantity: 10; Military Standard: Not; Voltage Rating: 75V; Length: 1.55mm; Height: 0.45mm; Width: 0.85mm; Depth: 0.85mm; Radiation Hardening: No; Lead Free: Lead Free; REACH SVHC: Unknown; ComponentLink1URL: https://datasheet.ciiva.com/11811/0900766b80d98afc-11811519.pdf?src-supplier=RSComponents; ComponentLink1Description: https://datasheet.ciiva.com/11811/0900766b80d98afc-11811519.pdf?src-supplier=RSComponents; ComponentLink2URL: https://datasheet.ciiva.com/2494/dcrcwe3-2494855.pdf?src-supplier=Digi-Key; ComponentLink2Description: https://datasheet.ciiva.com/2494/dcrcwe3-2494855.pdf?src-supplier=Digi-Key; ComponentLink3URL: https://datasheet.ciiva.com/8337/dcrcwe3-8337239.pdf?src-supplier=Avnet; ComponentLink3Description: https://datasheet.ciiva.com/8337/dcrcwe3-8337239.pdf?src-supplier=Avnet; ComponentLink4URL: https://datasheet.ciiva.com/2494/dcrcwe3-2494856.pdf?src-supplier=Digi-Key; ComponentLink4Description: https://datasheet.ciiva.com/2494/dcrcwe3-2494856.pdf?src-supplier=Digi-Key; ComponentLink5URL: https://datasheet.ciiva.com/2494/dcrcwe3-2494857.pdf?src-supplier=Digi-Key; ComponentLink5Description: https://datasheet.ciiva.com/2494/dcrcwe3-2494857.pdf?src-supplier=Digi-Key; ComponentLink6URL: https://datasheet.ciiva.com/16893/dcrcwe3-16893530.pdf?src-supplier=Avnet+Europe; ComponentLink6Description: https://datasheet.ciiva.com/16893/dcrcwe3-16893530.pdf?src-supplier=Avnet+Europe; ComponentLink7URL: https://datasheet.ciiva.com/16213/dcrcwe3-16213739.pdf?src-supplier=Future+Electronics; ComponentLink7Description: https://datasheet.ciiva.com/16213/dcrcwe3-16213739.pdf?src-supplier=Future+Electronics; ComponentLink8URL: https://datasheet.ciiva.com/7673/1697337-7673469.pdf?src-supplier=Element14; ComponentLink8Description: https://datasheet.ciiva.com/7673/1697337-7673469.pdf?src-supplier=Element14; ComponentLink9URL: https://datasheet.ciiva.com/7673/1697337-7673311.pdf?src-supplier=Element14; ComponentLink9Description: https://datasheet.ciiva.com/7673/1697337-7673311.pdf?src-supplier=Element14
R223 = CRCW06033M90FKEA: RES SMD 3.9M OHM 1% 1/10W 0603; Manufacturer: Vishay; Resistance: 3.9MR; Temperature Coefficient: 100ppm/°C; Voltage Rating (DC): 75V; Power Rating: 100mW; Supplier 1: Farnell; Supplier Part Number 1: 2138677; Manufacturer Part Number: CRCW06033M90FKEA; RoHS: Yes; Category: Chip SMD Resistors; Stock: 8779; Pricing: 10=0.04580, 100=0.01840, 500=0.01580, 1000=0.00700, 2500=0.00580 (EUR); Case/Package: 0603; Number of Pins: 2; Contact Plating: Tin; Case Code (Metric): 1608; Case Code (Imperial): 0603; Min Operating Temperature: -55°C; Max Operating Temperature: 155°C; Composition: Thick Film; Tolerance: 1%; Voltage Rating: 75V; Packaging: Tape and Reel; Package Quantity: 10; Number of Terminations: 2; Military Standard: Not; Features: Automotive AEC-Q200; Termination: SMD/SMT; Max Power Dissipation: 100mW; Length: 1.55mm; Height: 0.02inch; Width: 0.033inch; Depth: 0.85mm; Radiation Hardening: No; REACH SVHC: Unknown; Lead Free: Lead Free; ComponentLink1URL: https://datasheet.ciiva.com/11811/0900766b80d98afc-11811205.pdf?src-supplier=RSComponents; ComponentLink1Description: https://datasheet.ciiva.com/11811/0900766b80d98afc-11811205.pdf?src-supplier=RSComponents; ComponentLink2URL: https://datasheet.ciiva.com/7843/1697337-7843289.pdf?src-supplier=Element14; ComponentLink2Description: https://datasheet.ciiva.com/7843/1697337-7843289.pdf?src-supplier=Element14; ComponentLink3URL: https://datasheet.ciiva.com/8897/dcrcwe3-8897238.pdf?src-supplier=Avnet; ComponentLink3Description: https://datasheet.ciiva.com/8897/dcrcwe3-8897238.pdf?src-supplier=Avnet; ComponentLink4URL: https://datasheet.ciiva.com/7843/1697337-7843288.pdf?src-supplier=Element14; ComponentLink4Description: https://datasheet.ciiva.com/7843/1697337-7843288.pdf?src-supplier=Element14; ComponentLink5URL: https://datasheet.ciiva.com/22702/1697337-22702728.pdf?src-supplier=Element14; ComponentLink5Description: https://datasheet.ciiva.com/22702/1697337-22702728.pdf?src-supplier=Element14; ComponentLink6URL: https://datasheet.ciiva.com/2494/dcrcwe3-2494714.pdf?src-supplier=Digi-Key; ComponentLink6Description: https://datasheet.ciiva.com/2494/dcrcwe3-2494714.pdf?src-supplier=Digi-Key; ComponentLink7URL: https://datasheet.ciiva.com/2494/dcrcwe3-2494715.pdf?src-supplier=Digi-Key; ComponentLink7Description: https://datasheet.ciiva.com/2494/dcrcwe3-2494715.pdf?src-supplier=Digi-Key; ComponentLink8URL: https://datasheet.ciiva.com/22676/1912744-22676075.pdf?src-supplier=Element14; ComponentLink8Description: https://datasheet.ciiva.com/22676/1912744-22676075.pdf?src-supplier=Element14; ComponentLink9URL: https://datasheet.ciiva.com/2494/dcrcwe3-2494716.pdf?src-supplier=Digi-Key; ComponentLink9Description: https://datasheet.ciiva.com/2494/dcrcwe3-2494716.pdf?src-supplier=Digi-Key; ComponentLink10URL: https://datasheet.ciiva.com/16884/dcrcwe3-16884351.pdf?src-supplier=Avnet+Europe; ComponentLink10Description: https://datasheet.ciiva.com/16884/dcrcwe3-16884351.pdf?src-supplier=Avnet+Europe
REG1 = TS78L05CXRFG: TAIWAN SEMICONDUCTOR - TS78L05CX RFG - REG 3-TERMINAL 100MA, SMD, SOT23-3; Min Input Voltage: 0uV; Max Input Voltage: 35V; Number of Outputs: 1; Nominal Output Voltage: 5V; Supplier 1: Farnell; Supplier Part Number 1: 1476698; Manufacturer: Taiwan Semiconductor; Manufacturer Part Number: TS78L05CXRFG; Stock: 0; Pricing: 5=0.101, 50=0.099, 100=0.097, 250=0.0949, 500=0.0929, 1000=0.0909, 5000=0.0889, 10000=0.0869 (EUR); RoHS: Yes; Case/Package: SOT-23; Number of Pins: 3; Min Operating Temperature: 0°C; Max Operating Temperature: 125°C; Output Current: 100mA; Packaging: Cut Tape; REACH SVHC: No SVHC; ComponentLink1URL: http://www.farnell.com/datasheets/2044138.pdf?src-supplier=Farnell; ComponentLink1Description: http://www.farnell.com/datasheets/2044138.pdf?src-supplier=Farnell; ComponentLink2URL: http://www.farnell.com/datasheets/4546.pdf?src-supplier=Element14; ComponentLink2Description: http://www.farnell.com/datasheets/4546.pdf?src-supplier=Element14; ComponentLink3URL: http://www.taiwansemi.com/products/datasheet/TS78L00_I15.pdf?src-supplier=Digi-Key; ComponentLink3Description: http://www.taiwansemi.com/products/datasheet/TS78L00_I15.pdf?src-supplier=Digi-Key; Price: 0.262
U1 = ATTINY84A-SSU: MCU 8-bit ATtiny AVR RISC 8KB Flash 2.5V/3.3V/5V 14-Pin SOIC; Manufacturer: Microchip / Atmel; Data Bus Width: 8b; Oscillator Type: Internal; Max Frequency: 20MHz; Number of Programmable I/O: 12; Peripherals: Brown-out Detect/Reset,POR,PWM,WDT,Temp Sensor; Watchdog Timer: Yes; Interface: SPI; Max Supply Voltage: 5.5V; Min Supply Voltage: 1.8V; RAM Size: 512B; Number of Timers/Counters: 2; Number of I2C Channels: 1; Number of ADC Channels: 8; Supplier 1: Farnell; Supplier Part Number 1: 1972173; Manufacturer Part Number: ATTINY84A-SSU; RoHS: Yes; Category: Microcontrollers; Stock: 464; Pricing: 1=0.70200, 10=0.67100, 25=0.63900, 50=0.58800 (EUR); Mount: Surface Mount; Case/Package: SOIC; Number of Pins: 14; Contact Plating: Tin,Matte; Min Operating Temperature: -40°C; Max Operating Temperature: 85°C; Core Architecture: AVR; Package Quantity: 57; Memory Type: FLASH; Memory Size: 8KB; Frequency: 20MHz; Packaging: Rail/Tube; Number of I/Os: 12; Number of SPI Channels: 2; Number of PWM Channels: 2; Length: 8.74mm; Height: 1.75mm; Width: 3.99mm; Radiation Hardening: No; Lead Free: Lead Free; REACH SVHC: No SVHC; ComponentLink1URL: https://datasheet.ciiva.com/6639/8183s-6639804.pdf?src-supplier=Digi-Key; ComponentLink1Description: https://datasheet.ciiva.com/6639/8183s-6639804.pdf?src-supplier=Digi-Key; ComponentLink2URL: https://datasheet.ciiva.com/3203/8183s-3203999.pdf?src-supplier=Avnet; ComponentLink2Description: https://datasheet.ciiva.com/3203/8183s-3203999.pdf?src-supplier=Avnet

### Notes on the sheet
- (in symbol TS78L05CXRFG) I; O; G